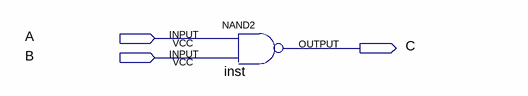
[diagram p0: schematic sheet]
// Quartus schematic NAND_VHDL.bdf as structural Verilog: 1 symbols, 3 pins
module NAND_VHDL (
  input  A,
  input  B,
  output C
);

  nand inst (C, A, B);
endmodule
